# EAGLE design WSON-8_2x3_Breakout (EAGLE 9.6.2)
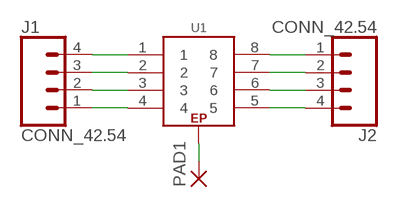
[diagram p0: schematic, sheet 1]

## Parts
J1  CONN_42.54  [1X04]
J2  CONN_42.54  [1X04]
PAD1  SMD2  [SMD1,27-2,54]
U1  GEN_8_EPWSON-8_2X3  [WSON-8_2X3]

## Nets
N$1: J1.1 U1.4
N$2: J1.2 U1.3
N$3: J1.3 U1.2
N$4: J1.4 U1.1
N$5: J2.1 U1.8
N$6: J2.2 U1.7
N$7: J2.3 U1.6
N$8: J2.4 U1.5
N$9: PAD1.1(P) U1.EP

## Library data of the parts
J1 J2 = bschulz:CONN_4: Genaric 4 terminal header Digikey 2.54_SCREW <https://www.digikey.com/product-detail/en/on-shore-technology-inc/OSTVN04A150/ED10563-ND/1588864>
PAD1 = bschulz:SMD2: SMD PAD; DIGIKEY: N/A; MF: N/A; MPN: DNP
U1 = bschulz:GEN_8_EP: Generic 8 Pin Package for Breakout Boards w/Exposed Pad

## Board
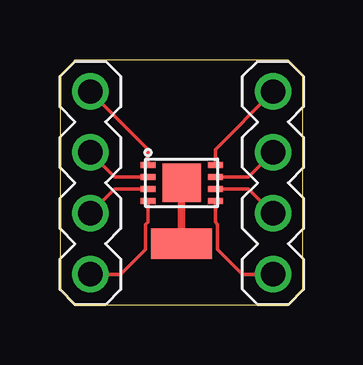
[diagram p1: board, top side]

Size 10.14 x 10.21 mm. Coordinates in mm from the lower left corner, seen from the top.
Outline: 9.51,10.21 0.64,10.21 0,9.58 0,0.64 0.64,0 9.51,0 10.14,0.64 10.14,9.58 9.51,10.21
Copper layers (1*16): Top 0.035559375mm / dielectric 1.6mm / Bottom 0.035559375mm
Design rules "oshpark-2layer": minimum track width 6mil, minimum drill 10mil, track to track 6mil, track to pad 6mil, pad to pad 6mil, via to via 6mil, smd to smd 6mil, copper to edge 15mil, drill to drill 6mil, minimum pad ring 5mil, minimum via ring 5mil, stop-mask expansion 2.5mil, vias tented up to drill 0mil, thermal gap 10mil

### Footprints (pad centres in the part's own frame; a part is rotated, then mirrored left to right if it is on the bottom)
1X04 = drill 1.016: 1 -3.81,0; 2 -1.27,0; 3 1.27,0; 4 3.81,0
SMD1,27-2,54 = smd 1.27 x 2.54: 1 0,0
WSON-8_2X3 = smd 0.25 x 0.625: 1 -0.75,-1.4; 2 -0.25,-1.4; 3 0.25,-1.4; 4 0.75,-1.4; 5 0.75,1.4; 6 0.25,1.4; 7 -0.25,1.4; 8 -0.75,1.4 | smd 1.6 x 1.6: EP 0,0

### Placement (x,y rotation side)
J1  1.27,5.08 90 top
J2  8.89,5.08 270 top
PAD1  5.08,2.54 90 top
U1  5.08,5.08 270 top

### Tracks (layer width: path | path; a pad name or v marks a point on that pad's centre or on a via)
N$1
  Top 0.152: J1.1 2.54,1.27 3.58,2.31 3.58,3.34 3.68,3.44 U1.4
N$2
  Top 0.152: J1.2 2.29,4.83 U1.3
N$3
  Top 0.152: J1.3 2.29,5.33 U1.2
N$4
  Top 0.152: J1.4 3.68,6.48 U1.1
N$5
  Top 0.152: J2.1 6.48,6.48 U1.8
N$6
  Top 0.152: J2.2 7.87,5.33 U1.7
N$7
  Top 0.152: J2.3 7.87,4.83 U1.6
N$8
  Top 0.152: J2.4 7.62,1.27 6.58,2.31 6.58,3.34 6.48,3.44 U1.5
N$9
  Top 0.305: U1.EP PAD1.1

### Text on the board
tDocu: 1 | 8 | WSON-8 | 2 | 7 | 3 | EP | 6 | 4 | Break44 / B. Schulz | 5